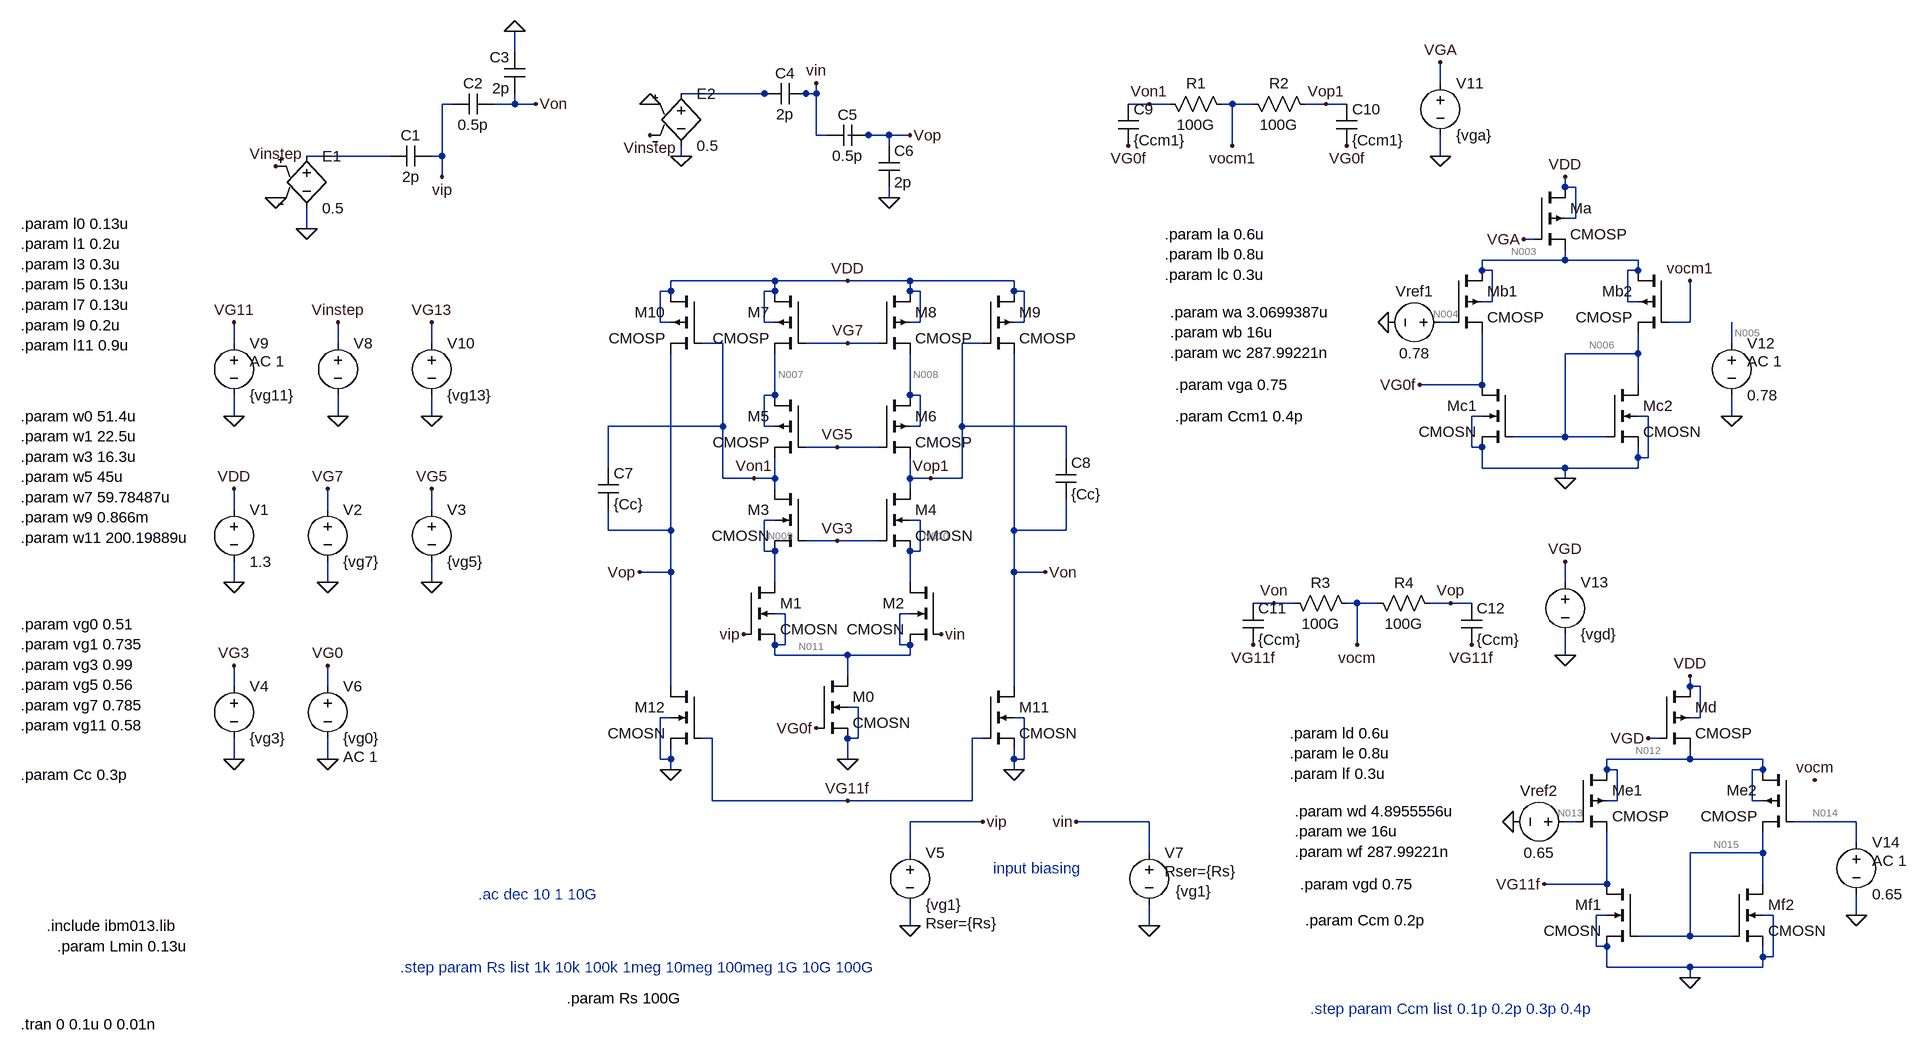
[diagram p0: schematic assignment5-last try.asc]
assignment5-last try.asc, the LTspice schematic file:
Version 4
SHEET 1 2840 788
WIRE -208 -816 -208 -848
WIRE 1216 -768 1216 -800
WIRE 176 -752 48 -752
WIRE 192 -752 176 -752
WIRE 240 -752 224 -752
WIRE 256 -752 256 -768
WIRE 256 -752 240 -752
WIRE -304 -736 -320 -736
WIRE -208 -736 -208 -752
WIRE -208 -736 -240 -736
WIRE -176 -736 -208 -736
WIRE 768 -736 736 -736
WIRE 800 -736 768 -736
WIRE 896 -736 880 -736
WIRE 928 -736 896 -736
WIRE 1040 -736 1008 -736
WIRE 1072 -736 1040 -736
WIRE 256 -688 256 -752
WIRE 272 -688 256 -688
WIRE 336 -688 304 -688
WIRE 368 -688 336 -688
WIRE 400 -688 368 -688
WIRE 368 -672 368 -688
WIRE 896 -672 896 -736
WIRE -400 -656 -528 -656
WIRE -320 -656 -320 -736
WIRE -320 -656 -336 -656
WIRE 48 -656 48 -672
WIRE 1216 -656 1216 -688
WIRE -320 -624 -320 -656
WIRE 1408 -608 1408 -624
WIRE 1424 -608 1408 -608
WIRE 368 -592 368 -608
WIRE 1424 -560 1424 -608
WIRE 1424 -560 1408 -560
WIRE -528 -544 -528 -576
WIRE 1360 -528 1344 -528
WIRE 1408 -496 1408 -512
WIRE 1408 -496 1280 -496
WIRE 1520 -496 1408 -496
WIRE 1280 -480 1280 -496
WIRE 1296 -480 1280 -480
WIRE 1520 -480 1520 -496
WIRE 1520 -480 1504 -480
WIRE 192 -464 32 -464
WIRE 304 -464 192 -464
WIRE 400 -464 304 -464
WIRE 560 -464 400 -464
WIRE 32 -448 32 -464
WIRE 32 -448 16 -448
WIRE 192 -448 192 -464
WIRE 192 -448 176 -448
WIRE 400 -448 400 -464
WIRE 416 -448 400 -448
WIRE 560 -448 560 -464
WIRE 576 -448 560 -448
WIRE 1296 -432 1296 -480
WIRE 1296 -432 1280 -432
WIRE 1504 -432 1504 -480
WIRE 1520 -432 1504 -432
WIRE 16 -400 16 -448
WIRE 32 -400 16 -400
WIRE 176 -400 176 -448
WIRE 192 -400 176 -400
WIRE 416 -400 416 -448
WIRE 416 -400 400 -400
WIRE 576 -400 576 -448
WIRE 576 -400 560 -400
WIRE 1232 -400 1216 -400
WIRE 1600 -400 1600 -464
WIRE 1600 -400 1568 -400
WIRE -640 -368 -640 -400
WIRE -480 -368 -480 -400
WIRE -336 -368 -336 -400
WIRE 112 -368 80 -368
WIRE 304 -368 240 -368
WIRE 352 -368 304 -368
WIRE 512 -368 480 -368
WIRE 1664 -368 1664 -400
WIRE 1520 -352 1520 -384
WIRE 1520 -352 1408 -352
WIRE 1280 -304 1280 -384
WIRE 1280 -304 1184 -304
WIRE 1520 -304 1520 -352
WIRE 192 -288 192 -352
WIRE 192 -288 176 -288
WIRE 400 -288 400 -352
WIRE 416 -288 400 -288
WIRE -640 -256 -640 -288
WIRE -480 -256 -480 -288
WIRE -336 -256 -336 -288
WIRE 1280 -256 1264 -256
WIRE 1536 -256 1520 -256
WIRE 1664 -256 1664 -288
WIRE 112 -240 112 -368
WIRE 112 -240 -64 -240
WIRE 176 -240 176 -288
WIRE 192 -240 176 -240
WIRE 416 -240 416 -288
WIRE 416 -240 400 -240
WIRE 480 -240 480 -368
WIRE 640 -240 480 -240
WIRE 1408 -224 1408 -352
WIRE 1408 -224 1328 -224
WIRE 1472 -224 1408 -224
WIRE 288 -208 240 -208
WIRE 352 -208 288 -208
WIRE 1264 -208 1264 -256
WIRE 1280 -208 1264 -208
WIRE 640 -192 640 -240
WIRE 1520 -192 1520 -208
WIRE 1536 -192 1536 -256
WIRE 1536 -192 1520 -192
WIRE -64 -176 -64 -240
WIRE 1280 -176 1280 -208
WIRE 1408 -176 1280 -176
WIRE 1520 -176 1520 -192
WIRE 1520 -176 1408 -176
WIRE 112 -160 112 -240
WIRE 160 -160 112 -160
WIRE 192 -160 192 -192
WIRE 192 -160 160 -160
WIRE 400 -160 400 -192
WIRE 432 -160 400 -160
WIRE 480 -160 480 -240
WIRE 480 -160 432 -160
WIRE 1408 -160 1408 -176
WIRE 192 -144 192 -160
WIRE 400 -144 400 -160
WIRE -640 -112 -640 -144
WIRE -496 -112 -496 -144
WIRE -336 -112 -336 -144
WIRE 192 -96 176 -96
WIRE 416 -96 400 -96
WIRE -64 -80 -64 -112
WIRE 32 -80 32 -352
WIRE 32 -80 -64 -80
WIRE 560 -80 560 -352
WIRE 640 -80 640 -128
WIRE 640 -80 560 -80
WIRE 288 -64 240 -64
WIRE 352 -64 288 -64
WIRE 176 -48 176 -96
WIRE 192 -48 176 -48
WIRE 416 -48 416 -96
WIRE 416 -48 400 -48
WIRE 32 -16 32 -80
WIRE 32 -16 -16 -16
WIRE 560 -16 560 -80
WIRE 608 -16 560 -16
WIRE -640 0 -640 -32
WIRE -496 0 -496 -32
WIRE -336 0 -336 -32
WIRE 192 0 192 -48
WIRE 400 0 400 -48
WIRE 1408 0 1408 -32
WIRE 960 32 928 32
WIRE 992 32 960 32
WIRE 1088 32 1072 32
WIRE 1120 32 1088 32
WIRE 1232 32 1200 32
WIRE 1264 32 1232 32
WIRE 208 48 192 48
WIRE 400 48 384 48
WIRE 208 96 208 48
WIRE 208 96 192 96
WIRE 384 96 384 48
WIRE 400 96 384 96
WIRE 1088 96 1088 32
WIRE 192 112 192 96
WIRE 304 112 192 112
WIRE 400 112 400 96
WIRE 400 112 304 112
WIRE 1408 112 1408 80
WIRE 304 144 304 112
WIRE -640 160 -640 128
WIRE -496 160 -496 128
WIRE 32 160 32 -16
WIRE 560 160 560 -16
WIRE 1600 160 1600 144
WIRE 1616 160 1600 160
WIRE 320 192 304 192
WIRE 32 208 16 208
WIRE 576 208 560 208
WIRE 1616 208 1616 160
WIRE 1616 208 1600 208
WIRE 96 240 80 240
WIRE 320 240 320 192
WIRE 320 240 304 240
WIRE 512 240 496 240
WIRE 1552 240 1536 240
WIRE -640 272 -640 240
WIRE -496 272 -496 240
WIRE 16 272 16 208
WIRE 32 272 32 256
WIRE 32 272 16 272
WIRE 304 272 304 240
WIRE 560 272 560 256
WIRE 576 272 576 208
WIRE 576 272 560 272
WIRE 1600 272 1600 256
WIRE 1600 272 1472 272
WIRE 1712 272 1600 272
WIRE 32 288 32 272
WIRE 560 288 560 272
WIRE 1472 288 1472 272
WIRE 1488 288 1472 288
WIRE 1712 288 1712 272
WIRE 1712 288 1696 288
WIRE 96 336 96 240
WIRE 304 336 96 336
WIRE 496 336 496 240
WIRE 496 336 304 336
WIRE 1488 336 1488 288
WIRE 1488 336 1472 336
WIRE 1696 336 1696 288
WIRE 1712 336 1696 336
WIRE 512 368 400 368
WIRE 768 368 656 368
WIRE 1424 368 1408 368
WIRE 1856 368 1760 368
WIRE 1856 400 1856 368
WIRE 400 416 400 368
WIRE 768 416 768 368
WIRE 1712 416 1712 384
WIRE 1712 416 1600 416
WIRE 1472 464 1472 384
WIRE 1472 464 1376 464
WIRE 1712 464 1712 416
WIRE 1472 512 1456 512
WIRE 1728 512 1712 512
WIRE 1856 512 1856 480
WIRE 400 528 400 496
WIRE 768 528 768 496
WIRE 1600 544 1600 416
WIRE 1600 544 1520 544
WIRE 1664 544 1600 544
WIRE 1456 560 1456 512
WIRE 1472 560 1456 560
WIRE 1712 576 1712 560
WIRE 1728 576 1728 512
WIRE 1728 576 1712 576
WIRE 1472 592 1472 560
WIRE 1600 592 1472 592
WIRE 1712 592 1712 576
WIRE 1712 592 1600 592
WIRE 1600 608 1600 592
FLAG 304 272 0
FLAG -640 0 0
FLAG -640 -144 VDD
FLAG -496 0 0
FLAG -496 -144 VG7
FLAG -336 0 0
FLAG -336 -144 VG5
FLAG -640 272 0
FLAG -640 128 VG3
FLAG 400 528 0
FLAG -496 272 0
FLAG -496 128 VG0
FLAG 304 -464 VDD
FLAG 304 -368 VG7
FLAG 288 -208 VG5
FLAG 288 -64 VG3
FLAG 144 80 vip
FLAG 448 80 vin
FLAG 256 224 VG0f
FLAG 160 -160 Von1
FLAG 432 -160 Vop1
FLAG 768 528 0
FLAG -208 -848 0
FLAG 368 -592 0
FLAG -176 -736 Von
FLAG 400 -688 Vop
FLAG 512 368 vip
FLAG 656 368 vin
FLAG -320 -624 vip
FLAG 256 -768 vin
FLAG -640 -256 0
FLAG -640 -400 VG11
FLAG 48 -656 0
FLAG -528 -544 0
FLAG -480 -256 0
FLAG -480 -400 Vinstep
FLAG -576 -592 0
FLAG -576 -640 Vinstep
FLAG 0 -736 0
FLAG 0 -688 Vinstep
FLAG 32 288 0
FLAG 560 288 0
FLAG 608 -16 Von
FLAG -16 -16 Vop
FLAG 304 336 VG11f
FLAG -336 -256 0
FLAG -336 -400 VG13
FLAG 1408 -624 VDD
FLAG 1408 -160 0
FLAG 1216 -656 0
FLAG 1216 -800 VGA
FLAG 768 -736 Von1
FLAG 1040 -736 Vop1
FLAG 1344 -528 VGA
FLAG 1136 -400 0
FLAG 896 -672 vocm1
FLAG 1600 -464 vocm1
FLAG 1664 -256 0
FLAG 1184 -304 VG0f
FLAG 736 -672 VG0f
FLAG 1072 -672 VG0f
FLAG 1600 144 VDD
FLAG 1600 608 0
FLAG 1408 112 0
FLAG 1408 -32 VGD
FLAG 960 32 Von
FLAG 1232 32 Vop
FLAG 1536 240 VGD
FLAG 1328 368 0
FLAG 1088 96 vocm
FLAG 1792 304 vocm
FLAG 1856 512 0
FLAG 1376 464 VG11f
FLAG 928 96 VG11f
FLAG 1264 96 VG11f
DATAFLAG 560 32 ""
DATAFLAG 480 -320 ""
DATAFLAG 192 -320 ""
DATAFLAG 192 -16 ""
DATAFLAG 320 112 ""
DATAFLAG 1280 -352 ""
DATAFLAG 1472 -496 ""
DATAFLAG 1472 416 ""
DATAFLAG 1664 272 ""
SYMBOL cmosn 144 0 R0
SYMATTR InstName M1
SYMATTR Value2 l={l1} w={w1} ad={2*Lmin*w1} as={2*Lmin*w1} pd={2*w1+4*Lmin} ps={2*w1+4*Lmin}
SYMBOL cmosn 448 0 M0
SYMATTR InstName M2
SYMATTR Value2 l={l1} w={w1} ad={2*Lmin*w1} as={2*Lmin*w1} pd={2*w1+4*Lmin} ps={2*w1+4*Lmin}
SYMBOL cmosn 240 -144 M0
SYMATTR InstName M3
SYMATTR Value2 l={l3} w={w3} ad={2*Lmin*w3} as={2*Lmin*w3} pd={2*w3+4*Lmin} ps={2*w3+4*Lmin}
SYMBOL cmosn 352 -144 R0
SYMATTR InstName M4
SYMATTR Value2 l={l3} w={w3} ad={2*Lmin*w3} as={2*Lmin*w3} pd={2*w3+4*Lmin} ps={2*w3+4*Lmin}
SYMBOL cmosp 240 -288 M0
SYMATTR InstName M5
SYMATTR Value2 l={l5} w={w5} ad={2*Lmin*w5} as={2*Lmin*w5} pd={2*w5+4*Lmin} ps={2*w5+4*Lmin}
SYMBOL cmosp 352 -288 R0
SYMATTR InstName M6
SYMATTR Value2 l={l5} w={w5} ad={2*Lmin*w5} as={2*Lmin*w5} pd={2*w5+4*Lmin} ps={2*w5+4*Lmin}
SYMBOL cmosp 240 -448 M0
SYMATTR InstName M7
SYMATTR Value2 l={l7} w={w7} ad={2*Lmin*w7} as={2*Lmin*w7} pd={2*w7+4*Lmin} ps={2*w7+4*Lmin}
SYMBOL cmosp 352 -448 R0
SYMATTR InstName M8
SYMATTR Value2 l={l7} w={w7} ad={2*Lmin*w7} as={2*Lmin*w7} pd={2*w7+4*Lmin} ps={2*w7+4*Lmin}
SYMBOL cmosn 256 144 R0
SYMATTR InstName M0
SYMATTR Value2 l={l0} w={w0} ad={2*Lmin*w0} as={2*Lmin*w0} pd={2*w0+4*Lmin} ps={2*w0+4*Lmin}
SYMBOL voltage -640 -128 R0
WINDOW 123 0 0 Left 0
WINDOW 39 0 0 Left 0
SYMATTR InstName V1
SYMATTR Value 1.3
SYMBOL voltage -496 -128 R0
WINDOW 123 0 0 Left 0
WINDOW 39 0 0 Left 0
SYMATTR InstName V2
SYMATTR Value {vg7}
SYMBOL voltage -336 -128 R0
WINDOW 123 0 0 Left 0
WINDOW 39 0 0 Left 0
SYMATTR InstName V3
SYMATTR Value {vg5}
SYMBOL voltage -640 144 R0
WINDOW 123 0 0 Left 0
WINDOW 39 0 0 Left 0
SYMATTR InstName V4
SYMATTR Value {vg3}
SYMBOL voltage 400 400 R0
WINDOW 123 24 124 Left 2
WINDOW 39 24 124 Left 2
SYMATTR SpiceLine Rser={Rs}
SYMATTR InstName V5
SYMATTR Value {vg1}
SYMBOL voltage -496 144 R0
WINDOW 123 24 124 Left 2
WINDOW 39 0 0 Left 0
SYMATTR Value2 AC 1
SYMATTR InstName V6
SYMATTR Value {vg0}
SYMBOL voltage 768 400 R0
WINDOW 123 24 44 Left 2
WINDOW 39 24 44 Left 2
WINDOW 3 41 75 Left 2
SYMATTR SpiceLine Rser={Rs}
SYMATTR Value {vg1}
SYMATTR InstName V7
SYMBOL cap -336 -672 R90
WINDOW 0 0 32 VBottom 2
WINDOW 3 32 32 VTop 2
SYMATTR InstName C1
SYMATTR Value 2p
SYMBOL cap -240 -752 R90
WINDOW 0 0 32 VBottom 2
WINDOW 3 32 32 VTop 2
SYMATTR InstName C2
SYMATTR Value 0.5p
SYMBOL cap -192 -752 R180
WINDOW 0 24 56 Left 2
WINDOW 3 24 8 Left 2
SYMATTR InstName C3
SYMATTR Value 2p
SYMBOL cap 176 -736 R270
WINDOW 0 32 32 VTop 2
WINDOW 3 0 32 VBottom 2
SYMATTR InstName C4
SYMATTR Value 2p
SYMBOL cap 272 -672 R270
WINDOW 0 32 32 VTop 2
WINDOW 3 0 32 VBottom 2
SYMATTR InstName C5
SYMATTR Value 0.5p
SYMBOL cap 352 -672 R0
SYMATTR InstName C6
SYMATTR Value 2p
SYMBOL voltage -640 -384 R0
WINDOW 123 24 44 Left 2
WINDOW 39 0 0 Left 0
SYMATTR Value2 AC 1
SYMATTR InstName V9
SYMATTR Value {vg11}
SYMBOL e -528 -672 R0
SYMATTR InstName E1
SYMATTR Value 0.5
SYMBOL e 48 -768 R0
SYMATTR InstName E2
SYMATTR Value 0.5
SYMBOL voltage -480 -384 R0
WINDOW 123 0 0 Left 0
WINDOW 39 0 0 Left 0
WINDOW 3 24 96 Invisible 2
SYMATTR Value PULSE(0 0.1 0 0 0 10 10)
SYMATTR InstName V8
SYMBOL cmosp 512 -448 R0
SYMATTR InstName M9
SYMATTR Value2 l={l9} w={w9} ad={2*Lmin*w9} as={2*Lmin*w9} pd={2*w9+4*Lmin} ps={2*w9+4*Lmin}
SYMBOL cmosp 80 -448 M0
SYMATTR InstName M10
SYMATTR Value2 l={l9} w={w9} ad={2*Lmin*w9} as={2*Lmin*w9} pd={2*w9+4*Lmin} ps={2*w9+4*Lmin}
SYMBOL cmosn 512 160 R0
SYMATTR InstName M11
SYMATTR Value2 l={l11} w={w11} ad={2*Lmin*w11} as={2*Lmin*w11} pd={2*w11+4*Lmin} ps={2*w11+4*Lmin}
SYMBOL cmosn 80 160 M0
SYMATTR InstName M12
SYMATTR Value2 l={l11} w={w11} ad={2*Lmin*w11} as={2*Lmin*w11} pd={2*w11+4*Lmin} ps={2*w11+4*Lmin}
SYMBOL voltage -336 -384 R0
WINDOW 123 0 0 Left 0
WINDOW 39 0 0 Left 0
SYMATTR InstName V10
SYMATTR Value {vg13}
SYMBOL cap -80 -176 R0
SYMATTR InstName C7
SYMATTR Value {Cc}
SYMBOL cap 624 -192 R0
SYMATTR InstName C8
SYMATTR Value {Cc}
SYMBOL cmosp 1360 -608 R0
SYMATTR InstName Ma
SYMATTR Value2 l={la} w={wa} ad={2*Lmin*wa} as={2*Lmin*wa} pd={2*wa+4*Lmin} ps={2*wa+4*Lmin}
SYMBOL cmosp 1232 -480 R0
SYMATTR InstName Mb1
SYMATTR Value2 l={lb} w={wb} ad={2*Lmin*wb} as={2*Lmin*wb} pd={2*wb+4*Lmin} ps={2*wb+4*Lmin}
SYMBOL cmosp 1568 -480 M0
SYMATTR InstName Mb2
SYMATTR Value2 l={lb} w={wb} ad={2*Lmin*wb} as={2*Lmin*wb} pd={2*wb+4*Lmin} ps={2*wb+4*Lmin}
SYMBOL cmosn 1328 -304 M0
SYMATTR InstName Mc1
SYMATTR Value2 l={lc} w={wc} ad={2*Lmin*wc} as={2*Lmin*wc} pd={2*wc+4*Lmin} ps={2*wc+4*Lmin}
SYMBOL cmosn 1472 -304 R0
SYMATTR InstName Mc2
SYMATTR Value2 l={lc} w={wc} ad={2*Lmin*wc} as={2*Lmin*wc} pd={2*wc+4*Lmin} ps={2*wc+4*Lmin}
SYMBOL voltage 1216 -784 R0
WINDOW 123 0 0 Left 0
WINDOW 39 0 0 Left 0
SYMATTR InstName V11
SYMATTR Value {vga}
SYMBOL res 784 -752 M90
WINDOW 0 0 56 VBottom 2
WINDOW 3 32 56 VTop 2
SYMATTR InstName R1
SYMATTR Value 100G
SYMBOL res 912 -752 M90
WINDOW 0 0 56 VBottom 2
WINDOW 3 32 56 VTop 2
SYMATTR InstName R2
SYMATTR Value 100G
SYMBOL voltage 1232 -400 R90
WINDOW 0 -32 56 VBottom 2
WINDOW 3 32 56 VTop 2
WINDOW 123 0 0 Left 0
WINDOW 39 0 0 Left 0
SYMATTR InstName Vref1
SYMATTR Value 0.78
SYMBOL voltage 1664 -384 R0
WINDOW 123 24 44 Left 2
WINDOW 39 0 0 Left 0
SYMATTR Value2 AC 1
SYMATTR InstName V12
SYMATTR Value 0.78
SYMBOL cap 720 -736 R0
SYMATTR InstName C9
SYMATTR Value {Ccm1}
SYMBOL cap 1056 -736 R0
SYMATTR InstName C10
SYMATTR Value {Ccm1}
SYMBOL cmosp 1552 160 R0
SYMATTR InstName Md
SYMATTR Value2 l={ld} w={wd} ad={2*Lmin*wd} as={2*Lmin*wd} pd={2*wd+4*Lmin} ps={2*wd+4*Lmin}
SYMBOL cmosp 1424 288 R0
SYMATTR InstName Me1
SYMATTR Value2 l={le} w={we} ad={2*Lmin*we} as={2*Lmin*we} pd={2*we+4*Lmin} ps={2*we+4*Lmin}
SYMBOL cmosp 1760 288 M0
SYMATTR InstName Me2
SYMATTR Value2 l={le} w={we} ad={2*Lmin*we} as={2*Lmin*we} pd={2*we+4*Lmin} ps={2*we+4*Lmin}
SYMBOL cmosn 1520 464 M0
SYMATTR InstName Mf1
SYMATTR Value2 l={lc} w={wc} ad={2*Lmin*wc} as={2*Lmin*wc} pd={2*wc+4*Lmin} ps={2*wc+4*Lmin}
SYMBOL cmosn 1664 464 R0
SYMATTR InstName Mf2
SYMATTR Value2 l={lc} w={wc} ad={2*Lmin*wc} as={2*Lmin*wc} pd={2*wc+4*Lmin} ps={2*wc+4*Lmin}
SYMBOL voltage 1408 -16 R0
WINDOW 123 0 0 Left 0
WINDOW 39 0 0 Left 0
SYMATTR InstName V13
SYMATTR Value {vgd}
SYMBOL res 976 16 M90
WINDOW 0 0 56 VBottom 2
WINDOW 3 32 56 VTop 2
SYMATTR InstName R3
SYMATTR Value 100G
SYMBOL res 1104 16 M90
WINDOW 0 0 56 VBottom 2
WINDOW 3 32 56 VTop 2
SYMATTR InstName R4
SYMATTR Value 100G
SYMBOL voltage 1424 368 R90
WINDOW 0 -32 56 VBottom 2
WINDOW 3 32 56 VTop 2
WINDOW 123 0 0 Left 0
WINDOW 39 0 0 Left 0
SYMATTR InstName Vref2
SYMATTR Value 0.65
SYMBOL voltage 1856 384 R0
WINDOW 123 24 44 Left 2
WINDOW 39 0 0 Left 0
SYMATTR Value2 AC 1
SYMATTR InstName V14
SYMATTR Value 0.65
SYMBOL cap 912 32 R0
SYMATTR InstName C11
SYMATTR Value {Ccm}
SYMBOL cap 1248 32 R0
SYMATTR InstName C12
SYMATTR Value {Ccm}
TEXT -968 -552 Left 2 !.param l0 0.13u\n.param l1 0.2u\n.param l3 0.3u\n.param l5 0.13u\n.param l7 0.13u\n.param l9 0.2u\n.param l11 0.9u
TEXT -968 -256 Left 2 !.param w0 51.4u\n.param w1 22.5u\n.param w3 16.3u\n.param w5 45u\n.param w7 59.78487u\n.param w9 0.866m\n.param w11 200.19889u
TEXT -968 64 Left 2 !.param vg0 0.51\n.param vg1 0.735\n.param vg3 0.99\n.param vg5 0.56\n.param vg7 0.785\n.param vg11 0.58
TEXT -264 480 Left 2 ;.ac dec 10 1 10G
TEXT -928 528 Left 2 !.include ibm013.lib
TEXT 528 440 Left 2 ;input biasing
TEXT -912 560 Left 2 !.param Lmin 0.13u
TEXT -968 296 Left 2 !.param Cc 0.3p
TEXT 792 -536 Left 2 !.param la 0.6u\n.param lb 0.8u\n.param lc 0.3u
TEXT 800 -416 Left 2 !.param wa 3.0699387u\n.param wb 16u\n.param wc 287.99221n
TEXT 808 -304 Left 2 !.param vga 0.75
TEXT 808 -256 Left 2 !.param Ccm1 0.4p
TEXT 984 232 Left 2 !.param ld 0.6u\n.param le 0.8u\n.param lf 0.3u
TEXT 992 352 Left 2 !.param wd 4.8955556u\n.param we 16u\n.param wf 287.99221n
TEXT 1000 464 Left 2 !.param vgd 0.75
TEXT 1008 520 Left 2 !.param Ccm 0.2p
TEXT 1016 656 Left 2 ;.step param Ccm list 0.1p 0.2p 0.3p 0.4p
TEXT -968 680 Left 2 !.tran 0 0.1u 0 0.01n
TEXT -384 592 Left 2 ;.step param Rs list 1k 10k 100k 1meg 10meg 100meg 1G 10G 100G
TEXT -128 640 Left 2 !.param Rs 100G

The netlist it stands for:
* assignment5-last try.asc
M1 N009 vip N011 N011 CMOSN l={l1} w={w1} ad={2*Lmin*w1} as={2*Lmin*w1} pd={2*w1+4*Lmin} ps={2*w1+4*Lmin}
M2 N010 vin N011 N011 CMOSN l={l1} w={w1} ad={2*Lmin*w1} as={2*Lmin*w1} pd={2*w1+4*Lmin} ps={2*w1+4*Lmin}
M3 Von1 VG3 N009 N009 CMOSN l={l3} w={w3} ad={2*Lmin*w3} as={2*Lmin*w3} pd={2*w3+4*Lmin} ps={2*w3+4*Lmin}
M4 Vop1 VG3 N010 N010 CMOSN l={l3} w={w3} ad={2*Lmin*w3} as={2*Lmin*w3} pd={2*w3+4*Lmin} ps={2*w3+4*Lmin}
M5 N007 VG5 Von1 N007 CMOSP l={l5} w={w5} ad={2*Lmin*w5} as={2*Lmin*w5} pd={2*w5+4*Lmin} ps={2*w5+4*Lmin}
M6 N008 VG5 Vop1 N008 CMOSP l={l5} w={w5} ad={2*Lmin*w5} as={2*Lmin*w5} pd={2*w5+4*Lmin} ps={2*w5+4*Lmin}
M7 VDD VG7 N007 VDD CMOSP l={l7} w={w7} ad={2*Lmin*w7} as={2*Lmin*w7} pd={2*w7+4*Lmin} ps={2*w7+4*Lmin}
M8 VDD VG7 N008 VDD CMOSP l={l7} w={w7} ad={2*Lmin*w7} as={2*Lmin*w7} pd={2*w7+4*Lmin} ps={2*w7+4*Lmin}
M0 N011 VG0f 0 0 CMOSN l={l0} w={w0} ad={2*Lmin*w0} as={2*Lmin*w0} pd={2*w0+4*Lmin} ps={2*w0+4*Lmin}
V1 VDD 0 1.3
V2 VG7 0 {vg7}
V3 VG5 0 {vg5}
V4 VG3 0 {vg3}
V5 vip 0 {vg1} Rser={Rs}
V6 VG0 0 {vg0} AC 1
V7 vin 0 {vg1} Rser={Rs}
C1 vip N002 2p
C2 Von vip 0.5p
C3 Von 0 2p
C4 N001 vin 2p
C5 vin Vop 0.5p
C6 Vop 0 2p
V9 VG11 0 {vg11} AC 1
E1 N002 0 Vinstep 0 0.5
E2 N001 0 0 Vinstep 0.5
V8 Vinstep 0 PULSE(0 0.1 0 0 0 10 10)
M9 VDD Vop1 Von VDD CMOSP l={l9} w={w9} ad={2*Lmin*w9} as={2*Lmin*w9} pd={2*w9+4*Lmin} ps={2*w9+4*Lmin}
M10 VDD Von1 Vop VDD CMOSP l={l9} w={w9} ad={2*Lmin*w9} as={2*Lmin*w9} pd={2*w9+4*Lmin} ps={2*w9+4*Lmin}
M11 Von VG11f 0 0 CMOSN l={l11} w={w11} ad={2*Lmin*w11} as={2*Lmin*w11} pd={2*w11+4*Lmin} ps={2*w11+4*Lmin}
M12 Vop VG11f 0 0 CMOSN l={l11} w={w11} ad={2*Lmin*w11} as={2*Lmin*w11} pd={2*w11+4*Lmin} ps={2*w11+4*Lmin}
V10 VG13 0 {vg13}
C7 Von1 Vop {Cc}
C8 Vop1 Von {Cc}
Ma VDD VGA N003 VDD CMOSP l={la} w={wa} ad={2*Lmin*wa} as={2*Lmin*wa} pd={2*wa+4*Lmin} ps={2*wa+4*Lmin}
Mb1 N003 N004 VG0f N003 CMOSP l={lb} w={wb} ad={2*Lmin*wb} as={2*Lmin*wb} pd={2*wb+4*Lmin} ps={2*wb+4*Lmin}
Mb2 N003 vocm1 N006 N003 CMOSP l={lb} w={wb} ad={2*Lmin*wb} as={2*Lmin*wb} pd={2*wb+4*Lmin} ps={2*wb+4*Lmin}
Mc1 VG0f N006 0 0 CMOSN l={lc} w={wc} ad={2*Lmin*wc} as={2*Lmin*wc} pd={2*wc+4*Lmin} ps={2*wc+4*Lmin}
Mc2 N006 N006 0 0 CMOSN l={lc} w={wc} ad={2*Lmin*wc} as={2*Lmin*wc} pd={2*wc+4*Lmin} ps={2*wc+4*Lmin}
V11 VGA 0 {vga}
R1 Von1 vocm1 100G
R2 vocm1 Vop1 100G
Vref1 N004 0 0.78
V12 N005 0 0.78 AC 1
C9 Von1 VG0f {Ccm1}
C10 Vop1 VG0f {Ccm1}
Md VDD VGD N012 VDD CMOSP l={ld} w={wd} ad={2*Lmin*wd} as={2*Lmin*wd} pd={2*wd+4*Lmin} ps={2*wd+4*Lmin}
Me1 N012 N013 VG11f N012 CMOSP l={le} w={we} ad={2*Lmin*we} as={2*Lmin*we} pd={2*we+4*Lmin} ps={2*we+4*Lmin}
Me2 N012 N014 N015 N012 CMOSP l={le} w={we} ad={2*Lmin*we} as={2*Lmin*we} pd={2*we+4*Lmin} ps={2*we+4*Lmin}
Mf1 VG11f N015 0 0 CMOSN l={lc} w={wc} ad={2*Lmin*wc} as={2*Lmin*wc} pd={2*wc+4*Lmin} ps={2*wc+4*Lmin}
Mf2 N015 N015 0 0 CMOSN l={lc} w={wc} ad={2*Lmin*wc} as={2*Lmin*wc} pd={2*wc+4*Lmin} ps={2*wc+4*Lmin}
V13 VGD 0 {vgd}
R3 Von vocm 100G
R4 vocm Vop 100G
Vref2 N013 0 0.65
V14 N014 0 0.65 AC 1
C11 Von VG11f {Ccm}
C12 Vop VG11f {Ccm}
.model NMOS NMOS
.model PMOS PMOS
.lib standard.mos
.param l0 0.13u
.param l1 0.2u
.param l3 0.3u
.param l5 0.13u
.param l7 0.13u
.param l9 0.2u
.param l11 0.9u
.param w0 51.4u
.param w1 22.5u
.param w3 16.3u
.param w5 45u
.param w7 59.78487u
.param w9 0.866m
.param w11 200.19889u
.param vg0 0.51
.param vg1 0.735
.param vg3 0.99
.param vg5 0.56
.param vg7 0.785
.param vg11 0.58
* .ac dec 10 1 10G
.include ibm013.lib
* input biasing
.param Lmin 0.13u
.param Cc 0.3p
.param la 0.6u
.param lb 0.8u
.param lc 0.3u
.param wa 3.0699387u
.param wb 16u
.param wc 287.99221n
.param vga 0.75
.param Ccm1 0.4p
.param ld 0.6u
.param le 0.8u
.param lf 0.3u
.param wd 4.8955556u
.param we 16u
.param wf 287.99221n
.param vgd 0.75
.param Ccm 0.2p
* .step param Ccm list 0.1p 0.2p 0.3p 0.4p
.tran 0 0.1u 0 0.01n
* .step param Rs list 1k 10k 100k 1meg 10meg 100meg 1G 10G 100G
.param Rs 100G
.backanno
.end

* Results of the author's LTspice run, read from the files saved beside the schematic
* Operating Point (first step), zero values left out:
*   rs = 1 k
*   V(n009) = 525.6 mV
*   V(vip) = 735 mV
*   V(n011) = 274.4 mV
*   V(n010) = 525.6 mV
*   V(vin) = 735 mV
*   V(von1) = 780 mV
*   V(vg3) = 990 mV
*   V(vop1) = 780 mV
*   V(n007) = 1.092 V
*   V(vg5) = 560 mV
*   V(n008) = 1.092 V
*   V(vdd) = 1.3 V
*   V(vg7) = 785 mV
*   V(vg0f) = 510 mV
*   V(vg0) = 510 mV
*   V(von) = 652 mV
*   V(vop) = 652 mV
*   V(vg11) = 580 mV
*   V(vg11f) = 580 mV
*   V(vga) = 750 mV
*   V(n003) = 1.098 V
*   V(n004) = 780 mV
*   V(vocm1) = 780 mV
*   V(n006) = 510 mV
*   V(n005) = 780 mV
*   V(vgd) = 750 mV
*   V(n012) = 1.01 V
*   V(n013) = 650 mV
*   V(n014) = 650 mV
*   V(n015) = 580 mV
*   V(vocm) = 652 mV
*   Id(Me2) = 13.79 µA
*   Is(Me2) = -13.79 µA
*   Id(Me1) = 13.79 µA
*   Is(Me1) = -13.79 µA
*   Id(Md) = 27.58 µA
*   Is(Md) = -27.58 µA
*   Id(Mb2) = 7.752 µA
*   Is(Mb2) = -7.752 µA
*   Id(Mb1) = 7.752 µA
*   Is(Mb1) = -7.752 µA
*   Id(Ma) = 15.5 µA
*   Is(Ma) = -15.5 µA
*   Id(M10) = 7.053 mA
*   Is(M10) = -7.053 mA
*   Id(M9) = 7.053 mA
*   Is(M9) = -7.053 mA
*   Id(M8) = 281 µA
*   Is(M8) = -281 µA
*   Id(M7) = 281 µA
*   Is(M7) = -281 µA
*   Id(M6) = 281 µA
*   Is(M6) = -281 µA
*   Id(M5) = 281 µA
*   Is(M5) = -281 µA
*   Id(Mf2) = 13.79 µA
*   Is(Mf2) = -13.79 µA
*   Id(Mf1) = 13.79 µA
*   Is(Mf1) = -13.79 µA
*   Id(Mc2) = 7.752 µA
*   Is(Mc2) = -7.752 µA
*   Id(Mc1) = 7.752 µA
*   Is(Mc1) = -7.752 µA
*   Id(M12) = 7.053 mA
*   Is(M12) = -7.053 mA
*   Id(M11) = 7.053 mA
*   Is(M11) = -7.053 mA
*   Id(M0) = 562.1 µA
*   Is(M0) = -562.1 µA
*   Id(M4) = 281 µA
*   Is(M4) = -281 µA
*   Id(M3) = 281 µA
*   Is(M3) = -281 µA
*   Id(M2) = 281 µA
*   Is(M2) = -281 µA
*   Id(M1) = 281 µA
*   Is(M1) = -281 µA
*   I(V1) = -14.71 mA
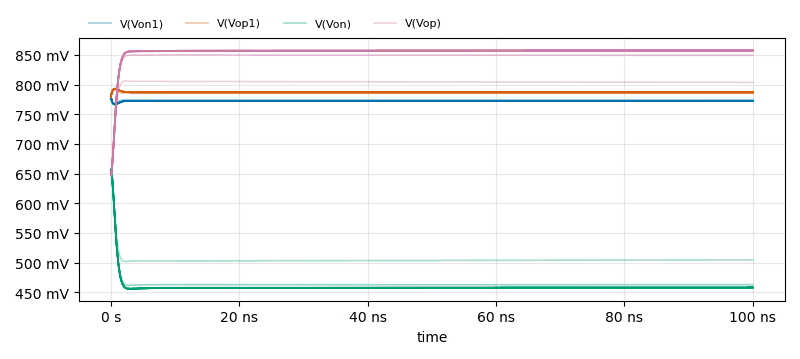
[diagram p1: Transient Analysis of assignment5-last try.asc, plotted from the saved traces]
* Transient Analysis, 9 runs:
*   V(Von1) [run 1]: min 768.4 mV, max 780 mV, average 774.6 mV, rms 774.6 mV, last 774.7 mV
*   V(Von1) [run 2]: min 766.9 mV, max 780 mV, average 772.9 mV, rms 772.9 mV, last 773 mV
*   V(Von1) [run 3]: min 766.8 mV, max 780 mV, average 772.6 mV, rms 772.6 mV, last 772.7 mV
*   V(Von1) [run 4]: min 766.7 mV, max 780 mV, average 772.6 mV, rms 772.6 mV, last 772.6 mV
*   V(Von1) [run 5]: min 766.7 mV, max 780 mV, average 772.6 mV, rms 772.6 mV, last 772.6 mV
*   V(Von1) [run 6]: min 766.7 mV, max 780 mV, average 772.6 mV, rms 772.6 mV, last 772.6 mV
*   V(Von1) [run 7]: min 766.7 mV, max 780 mV, average 772.6 mV, rms 772.6 mV, last 772.6 mV
*   V(Von1) [run 8]: min 766.7 mV, max 780 mV, average 772.6 mV, rms 772.6 mV, last 772.6 mV
*   V(Vop1) [run 1]: min 780 mV, max 791.6 mV, average 785.4 mV, rms 785.4 mV, last 785.3 mV
*   V(Vop1) [run 2]: min 780 mV, max 793 mV, average 787 mV, rms 787 mV, last 787 mV
*   V(Vop1) [run 3]: min 780 mV, max 793.2 mV, average 787.2 mV, rms 787.2 mV, last 787.1 mV
*   V(Vop1) [run 4]: min 780 mV, max 793.2 mV, average 787.2 mV, rms 787.2 mV, last 787.1 mV
*   V(Vop1) [run 5]: min 780 mV, max 793.2 mV, average 787.2 mV, rms 787.2 mV, last 787.1 mV
*   V(Vop1) [run 6]: min 780 mV, max 793.2 mV, average 787.2 mV, rms 787.2 mV, last 787.1 mV
*   V(Vop1) [run 7]: min 780 mV, max 793.2 mV, average 787.2 mV, rms 787.2 mV, last 787.1 mV
*   V(Vop1) [run 8]: min 780 mV, max 793.2 mV, average 787.2 mV, rms 787.2 mV, last 787.1 mV
*   V(Von) [run 1]: min 501.9 mV, max 657.1 mV, average 504.7 mV, rms 504.8 mV, last 504.6 mV
*   V(Von) [run 2]: min 461.7 mV, max 657.1 mV, average 464.2 mV, rms 464.5 mV, last 462.8 mV
*   V(Von) [run 3]: min 456.5 mV, max 657.1 mV, average 459.6 mV, rms 459.8 mV, last 458.2 mV
*   V(Von) [run 4]: min 455.9 mV, max 657.1 mV, average 459.2 mV, rms 459.4 mV, last 458 mV
*   V(Von) [run 5]: min 455.9 mV, max 657.1 mV, average 459.2 mV, rms 459.4 mV, last 458 mV
*   V(Von) [run 6]: min 455.9 mV, max 657.1 mV, average 459.2 mV, rms 459.4 mV, last 458 mV
*   V(Von) [run 7]: min 455.9 mV, max 657.1 mV, average 459.2 mV, rms 459.4 mV, last 458 mV
*   V(Von) [run 8]: min 455.9 mV, max 657.1 mV, average 459.2 mV, rms 459.4 mV, last 458 mV
*   V(Vop) [run 1]: min 646.9 mV, max 806.3 mV, average 803.6 mV, rms 803.7 mV, last 803.8 mV
*   V(Vop) [run 2]: min 646.9 mV, max 850.2 mV, average 848.2 mV, rms 848.3 mV, last 849.6 mV
*   V(Vop) [run 3]: min 646.9 mV, max 856.6 mV, average 854.8 mV, rms 854.9 mV, last 856.6 mV
*   V(Vop) [run 4]: min 646.9 mV, max 857.7 mV, average 855.6 mV, rms 855.7 mV, last 857.7 mV
*   V(Vop) [run 5]: min 646.9 mV, max 857.8 mV, average 855.7 mV, rms 855.8 mV, last 857.8 mV
*   V(Vop) [run 6]: min 646.9 mV, max 857.8 mV, average 855.7 mV, rms 855.8 mV, last 857.8 mV
*   V(Vop) [run 7]: min 646.9 mV, max 857.8 mV, average 855.7 mV, rms 855.8 mV, last 857.8 mV
*   V(Vop) [run 8]: min 646.9 mV, max 857.8 mV, average 855.7 mV, rms 855.8 mV, last 857.8 mV